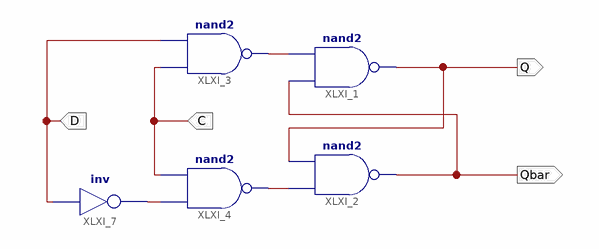
[diagram p0: schematic sheet 1]
// Xilinx ISE schematic D_LATCH.sch (kintex7) as structural Verilog: 5 symbols, 4 ports
module D_LATCH (
  input  C,
  input  D,
  output Q,
  output Qbar
);

  wire XLXN_7, XLXN_8, XLXN_14;

  nand XLXI_1 (Q, Qbar, XLXN_7);
  nand XLXI_2 (Qbar, XLXN_8, Q);
  nand XLXI_3 (XLXN_7, C, D);
  nand XLXI_4 (XLXN_8, XLXN_14, C);
  not XLXI_7 (XLXN_14, D);
endmodule
